# EAGLE design EncoderPCB_V3 (EAGLE 9.5.2)
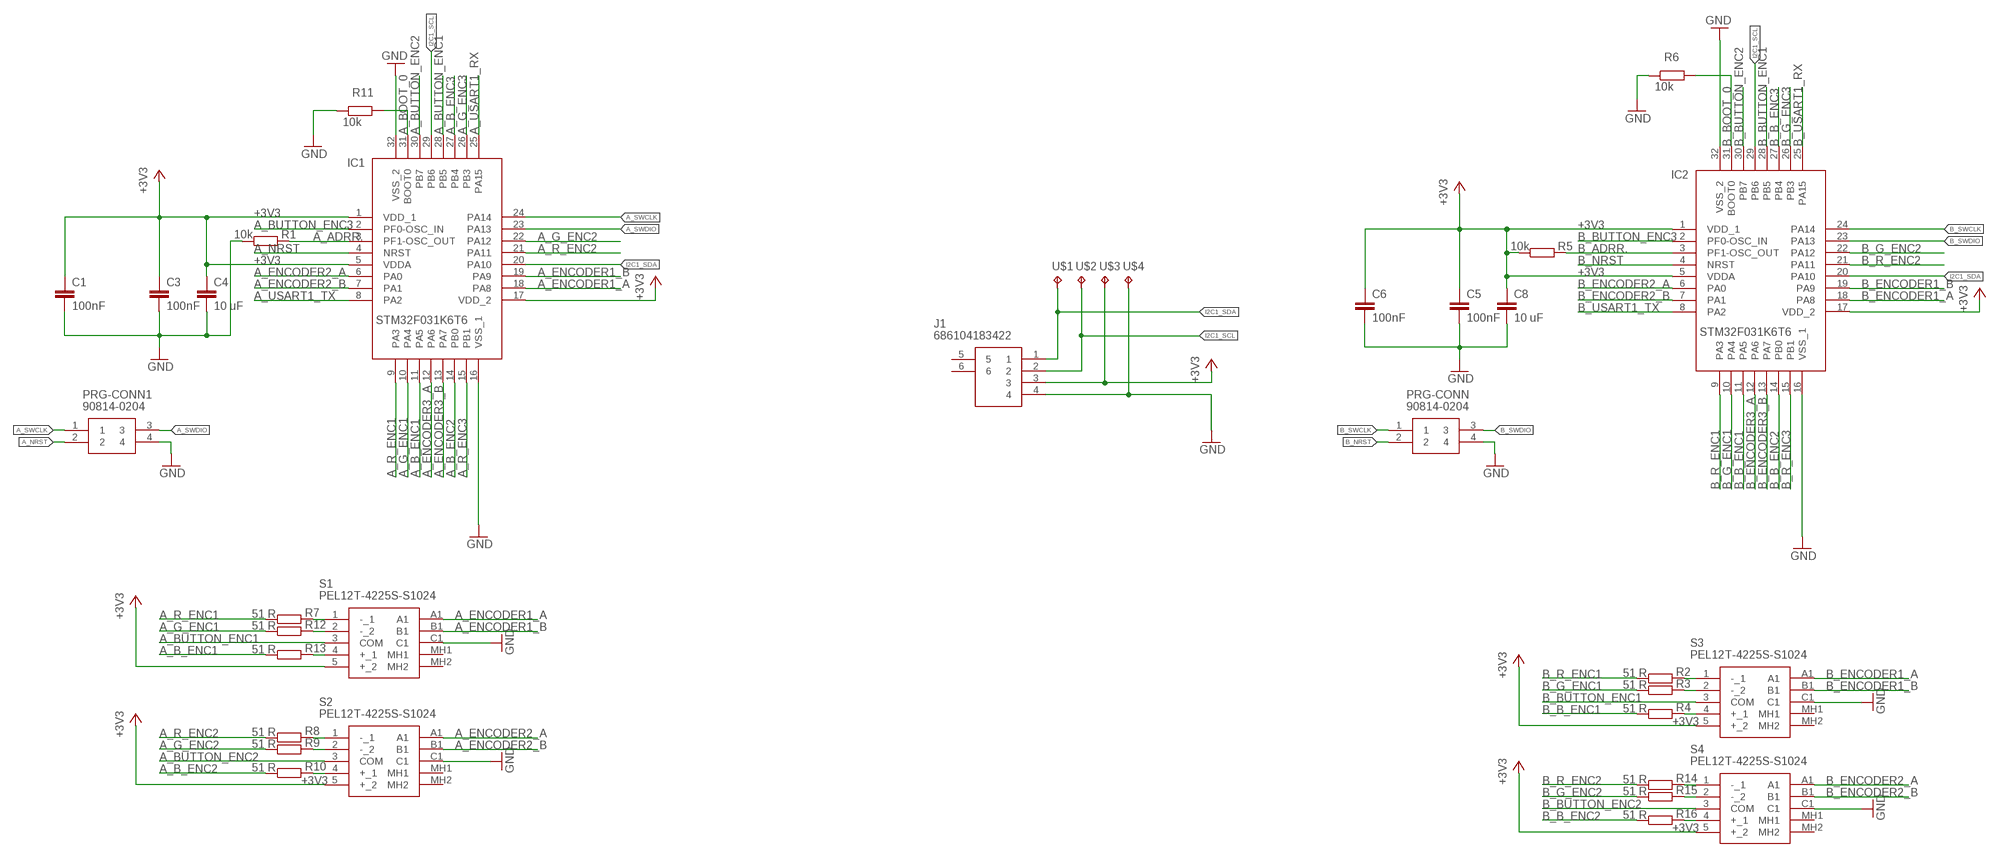
[diagram p0: schematic, sheet 1]

## Parts
C1  100nF  CAPACITOR"  [C0603]
C3  100nF  CAPACITOR"  [C0603]
C4  10 uF  CAPACITOR_1206  [C1206]
C5  100nF  CAPACITOR"  [C0603]
C6  100nF  CAPACITOR"  [C0603]
C8  10 uF  CAPACITOR_1206  [C1206]
IC1  STM32F031K6T6  [QFP80P900X900X160-32N]
IC2  STM32F031K6T6  [QFP80P900X900X160-32N]
J1  686104183422  [686104183422]
PRG-CONN  90814-0204  [MOLEX_90814-0204]
PRG-CONN1  90814-0204  [MOLEX_90814-0204]
R1  10k  RESISTOR_0603  [R0603]
R2  51 R  RESISTOR_0603  [R0603]
R3  51 R  RESISTOR_0603  [R0603]
R4  51 R  RESISTOR_0603  [R0603]
R5  10k  RESISTOR_0603  [R0603]
R6  10k  RESISTOR_0603  [R0603]
R7  51 R  RESISTOR_0603  [R0603]
R8  51 R  RESISTOR_0603  [R0603]
R9  51 R  RESISTOR_0603  [R0603]
R10  51 R  RESISTOR_0603  [R0603]
R11  10k  RESISTOR_0603  [R0603]
R12  51 R  RESISTOR_0603  [R0603]
R13  51 R  RESISTOR_0603  [R0603]
R14  51 R  RESISTOR_0603  [R0603]
R15  51 R  RESISTOR_0603  [R0603]
R16  51 R  RESISTOR_0603  [R0603]
S1  PEL12T-4225S-S1024  [PEL12T4225SS1024]
S2  PEL12T-4225S-S1024  [PEL12T4225SS1024]
S3  PEL12T-4225S-S1024  [PEL12T4225SS1024]
S4  PEL12T-4225S-S1024  [PEL12T4225SS1024]
U$1  TP  [OVAL_PAD]
U$2  TP  [OVAL_PAD]
U$3  TP  [OVAL_PAD]
U$4  TP  [OVAL_PAD]

## Nets
+3V3: C1.1 C3.1 C4.1 C5.1 C6.1 C8.1 IC1.1(VDD_1) IC1.5(VDDA) IC1.17(VDD_2) IC2.1(VDD_1) IC2.5(VDDA) IC2.17(VDD_2) J1.3 R5.1 S1.5(+_2) S2.5(+_2) S3.5(+_2) S4.5(+_2) U$3.P$1(TP)
A_ADRR.: IC1.3(PF1-OSC_OUT) R1.2
A_B_ENC1: IC1.11(PA5) R13.1
A_B_ENC2: IC1.14(PB0) R10.1
A_B_ENC3: IC1.27(PB4)
A_BOOT_0: IC1.31(BOOT0) R11.2
A_BUTTON_ENC1: IC1.28(PB5) S1.3(COM)
A_BUTTON_ENC2: IC1.30(PB7) S2.3(COM)
A_BUTTON_ENC3: IC1.2(PF0-OSC_IN)
A_ENCODER1_A: IC1.18(PA8) S1.A1
A_ENCODER1_B: IC1.19(PA9) S1.B1
A_ENCODER2_A: IC1.6(PA0) S2.A1
A_ENCODER2_B: IC1.7(PA1) S2.B1
A_ENCODER3_A: IC1.12(PA6)
A_ENCODER3_B: IC1.13(PA7)
A_G_ENC1: IC1.10(PA4) R12.1
A_G_ENC2: IC1.22(PA12) R9.1
A_G_ENC3: IC1.26(PB3)
A_NRST: IC1.4(NRST) PRG-CONN1.2
A_R_ENC1: IC1.9(PA3) R7.1
A_R_ENC2: IC1.21(PA11) R8.1
A_R_ENC3: IC1.15(PB1)
A_SWCLK: IC1.24(PA14) PRG-CONN1.1
A_SWDIO: IC1.23(PA13) PRG-CONN1.3
A_USART1_RX: IC1.25(PA15)
A_USART1_TX: IC1.8(PA2)
B_ADRR.: IC2.3(PF1-OSC_OUT) R5.2
B_B_ENC1: IC2.11(PA5) R4.1
B_B_ENC2: IC2.14(PB0) R16.1
B_B_ENC3: IC2.27(PB4)
B_BOOT_0: IC2.31(BOOT0) R6.2
B_BUTTON_ENC1: IC2.28(PB5) S3.3(COM)
B_BUTTON_ENC2: IC2.30(PB7) S4.3(COM)
B_BUTTON_ENC3: IC2.2(PF0-OSC_IN)
B_ENCODER1_A: IC2.18(PA8) S3.A1
B_ENCODER1_B: IC2.19(PA9) S3.B1
B_ENCODER2_A: IC2.6(PA0) S4.A1
B_ENCODER2_B: IC2.7(PA1) S4.B1
B_ENCODER3_A: IC2.12(PA6)
B_ENCODER3_B: IC2.13(PA7)
B_G_ENC1: IC2.10(PA4) R3.1
B_G_ENC2: IC2.22(PA12) R15.1
B_G_ENC3: IC2.26(PB3)
B_NRST: IC2.4(NRST) PRG-CONN.2
B_R_ENC1: IC2.9(PA3) R2.1
B_R_ENC2: IC2.21(PA11) R14.1
B_R_ENC3: IC2.15(PB1)
B_SWCLK: IC2.24(PA14) PRG-CONN.1
B_SWDIO: IC2.23(PA13) PRG-CONN.3
B_USART1_RX: IC2.25(PA15)
B_USART1_TX: IC2.8(PA2)
GND: C1.2 C3.2 C4.2 C5.2 C6.2 C8.2 IC1.16(VSS_1) IC1.32(VSS_2) IC2.16(VSS_1) IC2.32(VSS_2) J1.4 PRG-CONN1.4 PRG-CONN.4 R1.1 R6.1 R11.1 S1.C1 S2.C1 S3.C1 S4.C1 U$4.P$1(TP)
I2C1_SCL: IC1.29(PB6) IC2.29(PB6) J1.2 U$2.P$1(TP)
I2C1_SDA: IC1.20(PA10) IC2.20(PA10) J1.1 U$1.P$1(TP)
N$1: R7.2 S1.1(-_1)
N$2: R12.2 S1.2(-_2)
N$3: R13.2 S1.4(+_1)
N$4: R14.2 S4.1(-_1)
N$5: R15.2 S4.2(-_2)
N$6: R16.2 S4.4(+_1)
N$9: R2.2 S3.1(-_1)
N$10: R3.2 S3.2(-_2)
N$12: R4.2 S3.4(+_1)
N$15: R8.2 S2.1(-_1)
N$16: R9.2 S2.2(-_2)
N$17: R10.2 S2.4(+_1)
Unconnected: J1.5 J1.6 S1.MH1 S1.MH2 S2.MH1 S2.MH2 S3.MH1 S3.MH2 S4.MH1 S4.MH2

## Library data of the parts
C1 C3 C5 C6 = C_Sager_Bibliothek:CAPACITOR: capacitor
C4 C8 = passive components:CAPACITOR: ceramic capacitor
IC1 IC2 = C_Sager_Bibliothek:STM32F031K6T6: ARM Microcontrollers - MCU 16/32-BITS MICROS Source: Datasheet <https://componentsearchengine.com/Datasheets/1/STM32F031K6T6.pdf>; DESCRIPTION: ARM Microcontrollers - MCU 16/32-BITS MICROS; HEIGHT: 1.6mm; MANUFACTURER_NAME: STMicroelectronics; MANUFACTURER_PART_NUMBER: STM32F031K6T6; MOUSER_PART_NUMBER: 511-STM32F031K6T6; MOUSER_PRICE-STOCK: https://www.mouser.com/Search/Refine.aspx?Keyword=511-STM32F031K6T6
J1 = electro_mechanical:686104183422: Wurth Elektronik WR-FPC Series 1mm Pitch 4 Way Horizontal SMT Female FPC Connector, Top Contact Source: Datasheet <https://componentsearchengine.com/Datasheets/1/686104183422.pdf>; DESCRIPTION: Wurth Elektronik WR-FPC Series 1mm Pitch 4 Way Horizontal SMT Female FPC Connector, Top Contact; HEIGHT: 1.3mm; MANUFACTURER_NAME: Wurth Elektronik; MANUFACTURER_PART_NUMBER: 686104183422; MOUSER_PART_NUMBER: 710-686104183422; MOUSER_PRICE-STOCK: https://www.mouser.com/Search/Refine.aspx?Keyword=710-686104183422
PRG-CONN PRG-CONN1 = electro_mechanical:90814-0204: CONN HEADER 4POS 1.27MM SMD TIN Source: Datasheet <https://componentsearchengine.com/Datasheets/1/90814-0204.pdf>; DESCRIPTION: CONN HEADER 4POS 1.27MM SMD TIN; HEIGHT: mm; MANUFACTURER_NAME: Molex; MANUFACTURER_PART_NUMBER: 90814-0204; MOUSER_PART_NUMBER: 538-90814-0204; MOUSER_PRICE-STOCK: https://www.mouser.com/Search/Refine.aspx?Keyword=538-90814-0204
R1-R16 = passive components:RESISTOR: +/- 5 % resistor
S1-S4 = electro_mechanical:PEL12T-4225S-S1024: Encoders Red Blue/Green LED Push Switch Knurled Source: Datasheet <https://componentsearchengine.com/Datasheets/1/PEL12T-4225S-S1024.pdf>; DESCRIPTION: Encoders Red Blue/Green LED Push Switch Knurled; HEIGHT: 25mm; MANUFACTURER_NAME: Bourns; MANUFACTURER_PART_NUMBER: PEL12T-4225S-S1024; MOUSER_PART_NUMBER: 652-PEL12T4225SS1024; MOUSER_PRICE-STOCK: https://www.mouser.com/Search/Refine.aspx?Keyword=652-PEL12T4225SS1024
U$1-U$4 = C_Sager_Bibliothek:TP

## Board
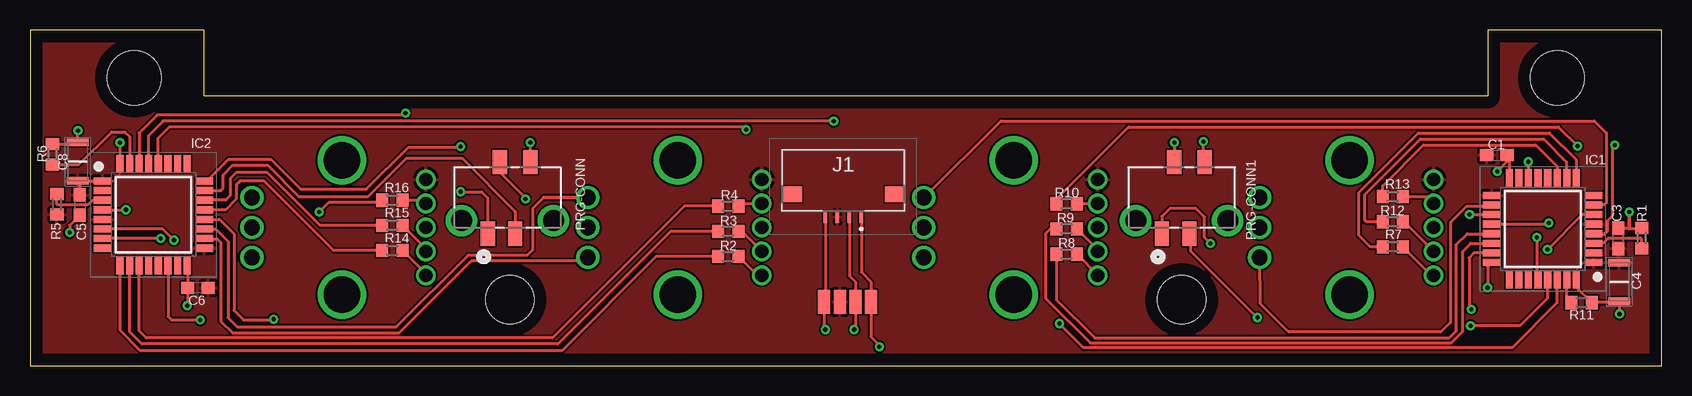
[diagram p1: board, top side]
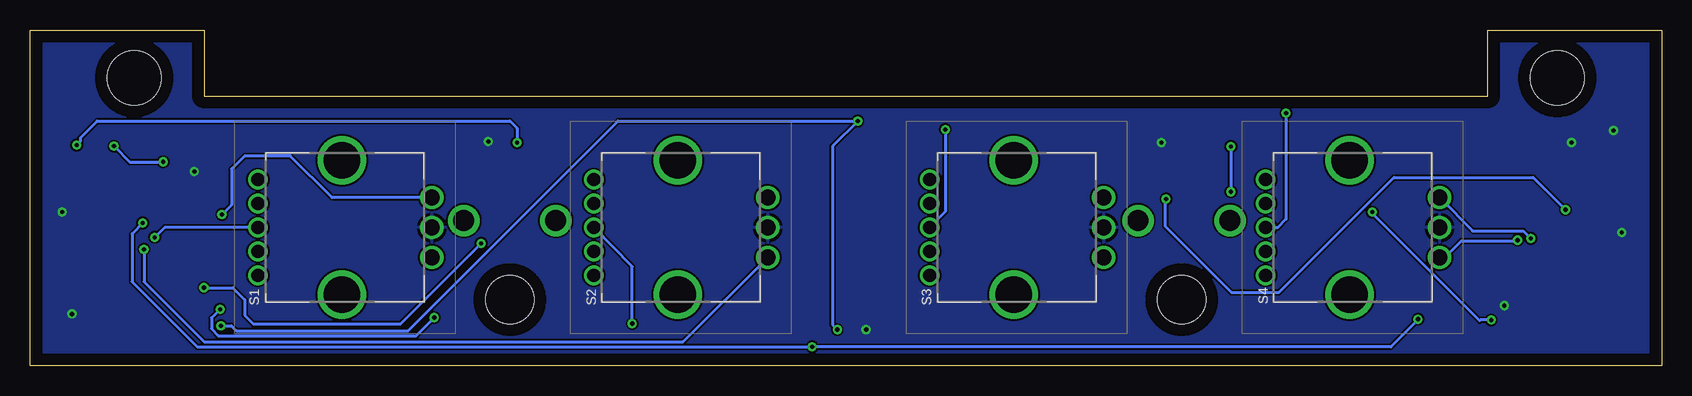
[diagram p2: board, bottom side, seen from below]

Size 136 x 28 mm. Coordinates in mm from the lower left corner, seen from the top.
Outline: 0,0 136,0 136,28 121.5,28 121.5,22.5 14.5,22.5 14.5,28 0,28 0,0
Copper layers (1*16): Top 0.035mm / dielectric 1.5mm / Bottom 0.035mm
Design rules "2layer": minimum track width 6mil, minimum drill 0.35mm, track to track 6mil, track to pad 6mil, pad to pad 6mil, via to via 6mil, smd to smd 6mil, copper to edge 40mil, drill to drill 6mil, minimum pad ring 10mil, minimum via ring 8mil, stop-mask expansion 4mil, vias tented up to drill 0mil, thermal gap 10mil
Holes 4 mm at 96,5.5 40,5.5
Holes 4.5 mm at 8.69,24 127.31,24

### Footprints (pad centres in the part's own frame; a part is rotated, then mirrored left to right if it is on the bottom)
C0603 = smd 1.1 x 1: 1 -0.85,0; 2 0.85,0
C1206 = smd 0.62 x 1.82: 1 -1.6,0; 2 1.6,0
QFP80P900X900X160-32N = smd 1.475 x 0.6: 1 -4.238,2.8; 2 -4.238,2; 3 -4.238,1.2; 4 -4.238,0.4; 5 -4.238,-0.4; 6 -4.238,-1.2; 7 -4.238,-2; 8 -4.238,-2.8; 17 4.238,-2.8; 18 4.238,-2; 19 4.238,-1.2; 20 4.238,-0.4; 21 4.238,0.4; 22 4.238,1.2; 23 4.238,2; 24 4.238,2.8 | smd 0.6 x 1.475: 9 -2.8,-4.238; 10 -2,-4.238; 11 -1.2,-4.238; 12 -0.4,-4.238; 13 0.4,-4.238; 14 1.2,-4.238; 15 2,-4.238; 16 2.8,-4.238; 25 2.8,4.238; 26 2,4.238; 27 1.2,4.238; 28 0.4,4.238; 29 -0.4,4.238; 30 -1.2,4.238; 31 -2,4.238; 32 -2.8,4.238
686104183422 = smd 0.3 x 1: 1 -1.5,1.9; 2 -0.5,1.9; 3 0.5,1.9; 4 1.5,1.9 | smd 1.65 x 1.3: 5 -4.275,0; 6 4.275,0
MOLEX_90814-0204 = smd 1.194 x 2.007: 1 0.254,0; 2 1.27,5.994; 3 2.54,0; 4 3.81,5.994 | drill 1.753 pad 2.629: 5 -1.93,1.092; 6 5.74,1.092
R0603 = smd 1 x 1.1: 1 -0.85,0; 2 0.85,0
PEL12T4225SS1024 = drill 1.1 pad 1.6: 1 -4,7; 2 -2,7; 3 0,7; 4 2,7; 5 4,7 | drill 1.3 pad 1.85: A1 -2.5,-7.5; B1 2.5,-7.5; C1 0,-7.5 | drill 3.041 pad 3.175: MH1 -5.6,0; MH2 5.6,0
OVAL_PAD = smd 1 x 2: P$1 0,0

### Placement (x,y rotation side)
C1  122.27,17.54 0 top
C3  132.4,10.6 90 top
C4  132.48,6.99 270 top
C5  4.15,13.4 270 top
C6  14,6.48 180 top
C8  3.98,17.01 90 top
IC1  126.1,11.4 180 top
IC2  10.3,12.6 0 top
J1  67.8,14.3 180 top
PRG-CONN  37.9,11 0 top
PRG-CONN1  94.1,11 0 top
R1  134.35,10.63 270 top
R2  58.2,9.1 0 top
R3  58.2,11.2 0 top
R4  58.2,13.3 0 top
R5  2.24,13.44 90 top
R6  1.88,17.62 270 top
R7  113.6,9.9 0 top
R8  86.4,9.3 0 top
R9  86.4,11.4 0 top
R10  86.4,13.5 0 top
R11  129.33,5.25 180 top
R12  113.6,12 0 top
R13  113.6,14.1 0 top
R14  30.2,9.6 0 top
R15  30.2,11.7 0 top
R16  30.2,13.8 0 top
S1  110,11.52 90 bottom
S2  82,11.52 90 bottom
S3  54,11.52 90 bottom
S4  26,11.52 90 bottom
U$1  70.1,5.3 0 top
U$2  68.8,5.3 0 top
U$3  67.5,5.3 0 top
U$4  66.2,5.3 0 top

### Tracks (layer width: path | path; a pad name or v marks a point on that pad's centre or on a via)
+3V3
  Top 0.254: C5.1 4.15,15.23 C8.1 IC2.1
  pour Top: 137,29.4 137,0 -0.5,0 -0.5,29.4
A_ADRR.
  Top 0.254: R1.2 134.35,10.58 134.33,10.6 131.54,10.6 131.14,10.2 IC1.3
A_B_ENC1
  Top 0.254: R13.1 112.75,15 116.15,18.4 125.5,18.4 127.3,16.6 IC1.11
A_B_ENC2  (via drill 0.35)
  Top 0.254: R10.1 85.37,13.68 85.35,13.68 91.57,19.9 127.4,19.9 v129,18.3 | v124.9,17 IC1.14
  Bottom 0.254: v129,18.3 127.7,17 v124.9,17
A_BOOT_0
  Top 0.254: R11.2 128.1,5.63 IC1.31
A_BUTTON_ENC1  (via drill 0.35)
  Top 0.254: IC1.28 125.67,7.13 125.6,7.2 v125.6,10.7
  Bottom 0.254: S1.3 124.78,11.52 v125.6,10.7
A_BUTTON_ENC2  (via drill 0.35)
  Top 0.254: IC1.30 127.28,7.14 127.28,5.21 123.56,1.49 87.81,1.49 v85.8,3.5
  Bottom 0.254: v85.8,3.5 85.8,8.27 S2.3
A_ENCODER1_A
  Top 0.254: IC1.18 121.72,13.26 119.73,13.26 118.4,11.93 118.4,3.6 117.6,2.8 104.9,2.8 102.55,5.15 S1.A1
A_ENCODER1_B  (via drill 0.35)
  Top 0.254: v120,12.6 IC1.19
  Bottom 0.254: S1.B1 110.82,14.02 114.3,17.5 118.1,17.5 119.2,16.4 119.2,13.4 v120,12.6
A_ENCODER2_A  (via drill 0.35)
  Top 0.254: IC1.6 129.4,12.6 v126.5,9.7
  Bottom 0.254: v126.5,9.7 126.5,7 121.5,2 81.57,2 S2.A1
A_ENCODER2_B
  Top 0.254: S2.B1 80.93,20.4 130.4,20.4 131.4,19.4 131.4,13.6 131.2,13.4 IC1.7
A_G_ENC1
  Top 0.254: IC1.10 128.08,15.66 128.08,17 126.17,18.91 115.91,18.91 111.27,14.27 111.27,12.13 111.41,12 R12.1
A_G_ENC2
  Top 0.254: R9.1 85.05,11.4 84.7,11.05 84.7,5.58 88.38,1.89 118.47,1.89 119.4,2.83 119.4,9.5 120.1,10.2 IC1.22
A_NRST  (via drill 0.35)
  Top 0.254: IC1.4 130.42,10.92 131.19,10.92 131.5,11.23 131.5,12.1 131.9,12.5 131.9,18.2 v132.1,18.4 | v95.4,18.6 95.4,17.02 PRG-CONN1.2
  Bottom 0.254: v132.1,18.4 131.8,18.7 131.8,19 130.4,20.4 96,20.4 95.4,19.8 v95.4,18.6
A_R_ENC1
  Top 0.254: R7.1 111.73,9.9 110.76,10.87 110.76,14.43 115.73,19.4 126.65,19.4 128.88,17.17 128.88,15.66 IC1.9
A_R_ENC2
  Top 0.254: R8.1 85.55,5.5 88.75,2.3 118.3,2.3 118.9,2.9 118.9,10.1 119.8,11 IC1.21
A_SWCLK  (via drill 0.35)
  Top 0.254: IC1.24 121.5,8.24 v121.5,6.5 | v98.4,10.2 97.9,10.7 97.9,12.4 97.2,13.1 95,13.1 94.35,12.45 PRG-CONN1.1
  Bottom 0.254: v121.5,6.5 119.1,6.5 118.1,5.5 118.1,4.2 117.4,3.5 105.1,3.5 v98.4,10.2
A_SWDIO  (via drill 0.35)
  Top 0.254: v120.16,4.7 119.96,4.9 119.96,9 120.36,9.4 IC1.23 | PRG-CONN1.3 96.7,10.94 96.74,10.94 96.74,9.56 v102.3,4
  Bottom 0.254: v120.16,4.7 120.86,4 120.86,3.07 120.29,2.5 103.8,2.5 v102.3,4
B_ADRR.
  Top 0.254: IC2.3 6.04,13.78 5.21,13.78 4.83,13.4 2.3,13.4 2.24,13.46 R5.2
B_B_ENC1
  Top 0.254: R4.1 54.55,13.3 43.55,2.3 9.7,2.3 9.1,2.9 IC2.11
B_B_ENC2  (via drill 0.35)
  Top 0.254: IC2.14 11.5,4.1 11.8,3.8 v14.2,3.8 | v24.1,12.8 24.9,13.6 29.15,13.6 R16.1
  Bottom 0.254: v24.1,12.8 24.1,12.7 15.15,3.75 15.1,3.8 v14.2,3.8
B_BOOT_0
  Top 0.254: R6.2 4.07,16.77 6.8,19.5 7.9,19.5 8.3,19.1 IC2.31
B_BUTTON_ENC1  (via drill 0.35)
  Top 0.254: IC2.28 10.7,19 11.63,19.93 59.47,19.93 v59.7,19.7
  Bottom 0.254: v59.7,19.7 59.7,12.87 S3.3
B_BUTTON_ENC2  (via drill 0.35)
  Top 0.254: v31.3,21.06 31.14,20.9 10.6,20.9 9.1,19.4 IC2.30
  Bottom 0.254: S4.3 32,11.52 31.3,12.22 v31.3,21.06
B_ENCODER1_A
  Top 0.254: IC2.18 14.56,10.58 15.59,10.58 15.9,10.27 15.9,3.7 16.89,2.71 30.77,2.71 36.77,8.72 46.25,8.72 S3.A1
B_ENCODER1_B
  Top 0.254: IC2.19 14.56,11.38 15.49,11.38 16.5,10.37 16.5,4 17.29,3.21 30.51,3.21 36.5,9.2 41.46,9.2 41.9,9.64 41.9,13.1 42.82,14.02
  Top 0.305: 42.82,14.02 S3.B1
B_ENCODER2_A  (via drill 0.35)
  Top 0.254: v12,10.46 11.06,11.4 IC2.6
  Bottom 0.254: S4.A1 18.05,9.02 16.67,10.4 12.06,10.4 v12,10.46
B_ENCODER2_B  (via drill 0.35)
  Top 0.254: v10.9,10.6 IC2.7
  Bottom 0.254: S4.B1 15.75,11.22 11.52,11.22 v10.9,10.6
B_G_ENC1
  Top 0.254: R3.1 53.4,11.2 44,1.8 9.32,1.8 8.32,2.81 8.32,8.34 IC2.10
B_G_ENC2
  Top 0.254: R15.1 24.18,11.7 19.77,16.11 17.21,16.11 16.69,15.59 16.69,14.2 16.29,13.8 IC2.22
B_NRST  (via drill 0.35)
  Top 0.254: IC2.4 v8,13 | v41.3,13.9 41.3,14 38.8,16.5 38.8,16.62 PRG-CONN.2
  Bottom 0.254: v41.3,13.9 41.35,13.85 41.35,11.6 35.85,6.1 31.9,6.1 22.3,15.7 10.7,15.7 v8,13
B_R_ENC1
  Top 0.254: R2.1 52.2,9.1 44.34,1.24 9.2,1.24 7.5,2.94 IC2.9
B_R_ENC2
  Top 0.254: R14.1 25.3,9.6 19.5,15.4 17.5,15.4 17.2,15.1 17.2,13.9 16.3,13 IC2.21
B_SWCLK  (via drill 0.35)
  Top 0.254: IC2.24 14.74,15.4 16.54,17.2 20.1,17.2 22.58,14.72 28.04,14.72 31.53,18.21 35.84,18.21 v35.9,18.27 | v35.9,14.5 37.65,14.5 38.15,14 PRG-CONN.1
  Bottom 0.254: v35.9,18.27 v35.9,14.5
B_SWDIO
  Top 0.254: IC2.23 15.9,14.6 16.09,14.79 16.09,15.89 16.91,16.71 19.79,16.71 22.39,14.11 28.21,14.11 31.39,17.3 36,17.3 40.44,12.86 PRG-CONN.3
GND  (via drill 0.35)
  Top 0.254: IC2.16 13.15,8.31 C6.2 13.15,5.05 v13.1,5 | C5.2 3.3,11.7 v3.3,11.1 | IC2.32 v7.5,18.6 | v4,19.6 3.98,19.58 C8.2 3.85,18.47 R6.1 | PRG-CONN.4 v41.71,18.59 v41.7,18.6 | IC1.16 123.3,17.36 C1.2 123.12,17.02 v122.3,16.2 | C3.2 133.3,11.45 v133.3,12.8 133.3,11.38 134.25,11.38 R1.1 | IC1.32 128.9,6.53 R11.1 132.34,5.25 C4.2 132.48,4.32 v132.5,4.3 | PRG-CONN1.4 97.8,17.1 v97.8,18.7 | v66.3,3 66.2,3.1 U$4.P$1 66.3,5.4 J1.4
  pour Bottom: 137,29.4 137,0 -0.5,0 -0.5,29.4
I2C1_SCL  (via drill 0.35)
  Top 0.254: IC2.29 9.9,19.2 11.1,20.4 v67,20.4 | IC1.29 126.48,7.14 126.48,5.61 124.19,3.31 v120.08,3.31 | J1.2 68.3,7.5 68.8,7 U$2.P$1 68.8,3.1 v68.7,3
  Bottom 0.254: v120.08,3.31 119.21,3.31 118.81,2.91 104.49,2.91 87,20.4 v67,20.4 69.1,18.3 69.1,3.4 v68.7,3
I2C1_SDA  (via drill 0.35)
  Top 0.254: IC2.20 15.8,12.2 17,11 17,4.6 17.8,3.8 20.1,3.8 20.17,3.87 v20.3,3.87 | IC1.20 126.5,11.8 v126.6,11.9 | J1.1 69.3,7.8 70.1,7 U$1.P$1 70.1,2.4 70.8,1.7 v70.8,1.56
  Bottom 0.254: v20.3,3.87 20.3,3.81 22.55,1.56 v70.8,1.56 122.06,1.56 127.5,7 127.5,11 v126.6,11.9
N$1
  Top 0.254: R7.2 116.83,7.52 S1.1
N$2
  Top 0.254: S1.2 114.57,12 R12.2
N$3
  Top 0.254: R13.2 116.47,14.1 S1.4
N$4
  Top 0.254: R14.2 33.05,7.6 S4.1
N$5
  Top 0.254: R15.2 33.05,9.7 S4.2
N$6
  Top 0.254: R16.2 32.77,13.8 S4.4
N$9
  Top 0.254: R2.2 60.63,7.52 S3.1
N$10
  Top 0.254: R3.2 59.37,11.2 S3.2
N$12
  Top 0.254: R4.2 59.27,13.52 S3.4
N$15
  Top 0.254: R8.2 89.03,7.52 S2.1
N$16
  Top 0.254: S2.2 89.05,9.6 R9.2
N$17
  Top 0.254: R10.2 87.27,13.52 S2.4